# Altium schematic sheet Battery_Prtection.SchDoc: Battery Protection
size A4; CompanyName: TechLabs Global Pvt Ltd; Organization: TechLabs Global Pvt Ltd; DocumentNumber: 1; Revision: 1.0; SheetNumber: 1; SheetTotal: 3
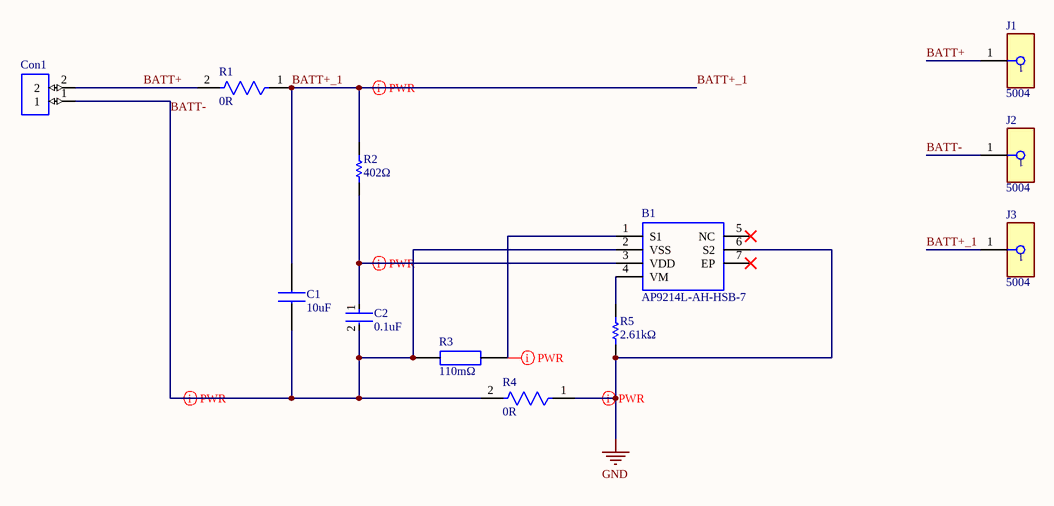
[diagram p0: Battery_Prtection.SchDoc]

## Parts
B1  AP9214L-AH-HSB-7  [AP9214LAHHSB7]
C1  10uF  [CAPC1005X70N]
C2  0.1uF  [FP-CC0402-MFG]
Con1  SM02B-SRSS-TB(LF)(SN)  [SM02B-SRSS-TB(LF)(SN)]  (value not drawn)
J1  5004  [FP-5004-MFG]
J2  5004  [FP-5004-MFG]
J3  5004  [FP-5004-MFG]
R1  0R  [FP-RC0402-0_4-IPC_A]
R2  402Ω  [RESC1005X40X25LL05T10]
R3  110mΩ  [RESC6432X65N]
R4  0R  [FP-RC0402-0_4-IPC_A]
R5  2.61kΩ  [RESC1005X40X25NL05T10]

## Nets
GND: B1.6(S2) R4.1 R5.1
BATT+: Con1.2 J1.1 R1.2
BATT+_1: C1.2 J3.1 R1.1 R2.2
BATT-: B1.2(VSS) C1.1 C2.2 Con1.1 J2.1 R3.1 R4.2
NetB1_1: B1.1(S1) R3.2
NetB1_3: B1.3(VDD) C2.1 R2.1
NetB1_4: B1.4(VM) R5.2

Not connected (* = marked no-connect by the designer): B1 5(NC)* 7(EP)*

## Layout directives
rule Width Constraint [Pref Width = 20mil    Min Width = 12mil    Max Width = 36mil]: BATT+_1, BATT-, GND, NetB1_1, NetB1_3

## Notes on the sheet
- Title
- Size:
- Date:
- A4
- Number:
- Time:
- Revision:
- Sheet
- of
- File:

## Library data of the parts
B1 = AP9214L-AH-HSB-7: Battery Management Sgl Chip Sol 1-Cell 30V Li Battery Mgt; Manufacturer: Diodes Inc.; Geometry.Height: 0.6mm; Mfr. Part #: AP9214L-AH-HSB-7; Mouser Part Number: 621-AP9214L-AH-HSB-7; Mouser Price/Stock: https://www.mouser.co.uk/ProductDetail/Diodes-Incorporated/AP9214L-AH-HSB-7?qs=QGmEbV89MVMVPmL%2Fj7c%2FKQ%3D%3D; Arrow Part Number: AP9214L-AH-HSB-7; Arrow Price/Stock: https://www.arrow.com/en/products/ap9214l-ah-hsb-7/diodes-incorporated; Mouser Testing Part Number: *; Mouser Testing Price/Stock: *; Datasheet Link: https://www.diodes.com/assets/Datasheets/AP9214L.pdf; Digi-Key Part #: AP9214L-AH-HSB-7DITR-ND,AP9214L-AH-HSB-7DICT-ND,AP9214L-AH-HSB-7DIDKR-ND; Package: U-DFN2535-6
C1 = CL05A106MQ5NUNC: CAP CER 10UF 6.3V X5R 0402; Manufacturer: Samsung Electro-Mechanics; Geometry.Height: 0.7mm; Mfr. Part #: CL05A106MQ5NUNC; Mouser Part Number: 187-CL05A106MQ5NUNC; Mouser Price/Stock: https://www.mouser.co.uk/ProductDetail/Samsung-Electro-Mechanics/CL05A106MQ5NUNC?qs=X6jEic%2FHinDK8vVLi1zwpw%3D%3D; Arrow Part Number: CL05A106MQ5NUNC; Arrow Price/Stock: https://www.arrow.com/en/products/cl05a106mq5nunc/samsung-electro-mechanics?region=nac; Datasheet Link: https://datasheet.datasheetarchive.com/originals/distributors/Datasheets-DGA10/2406160.pdf; LCSC Part #: C15525; Package: 0402; Value: 10uF; Digi-Key Part #: 1276-1451-2-ND
C2 = CMP-03422-000773-1: CAP CER 0.1UF 16V X5R 0402; Mfr. Part #: CC0402KRX5R7BB104; Manufacturer: YAGEO; Capacitance: 100 nF; Automotive Grade: NA; Temperature Coefficient: 30ppm/°C; Tolerance: 0.1; Material: Ceramic; Footprint Url: http://www.yageo.com/exep/pages/download/literatures/UPY-C_GEN_24.pdf; ComponentLink2Description: Datasheet; Digikey Description: CAP CER 0.1UF 16V X5R 0402; ComponentLink2URL: http://www.yageo.com/documents/recent/UPY-GP_NP0_16V-to-50V_16.pdf; Device Class L1: Passive Components; Temperature Range High: +125°C; Temperature Range Low: -55°C; Temperature: -55°C to +125°C; Temperature Characteristic: X5R; Octopart: https://octopart.com/cc0402krx5r7bb104-yageo-8376508; Device Class L2: Capacitors; Value: 0.1uF; Voltage Rating: 16 V; Automotive: No; Lead Free: Yes; Height: 0.55mm; Device Class L3: Ceramic Capacitors; Package: CC0402; Mouser Description: Multilayer Ceramic Capacitors MLCC - SMD/SMT 100nF 16V X5R 10%; Ipc Land Pattern Name: CAPC10050X50; RoHS: TRUE; Category: Cap; LCSC Part #: C106204; Digi-Key Part #: 311-1347-2-ND
Con1 = SM02B-SRSS-TB(LF)(SN): Connector Header Surface Mount, Right Angle 2 position 0.039 _1.00mm_; Manufacturer: JST Sales America; MP: SM02B-SRSS-TB_LF__SN_; MF: JST Sales; SnapEDA_Link: https://www.snapeda.com/parts/SM02B-SRSS-TB%28LF%29%28SN%29/JST%20Sales%20America%20Inc./view-part/447499/?ref=snap; Price: None; Value: *; Availability: Unavailable; Package: None; Digi-Key Part #: 455-1802-1-ND; LCSC Part #: C160402; Mfr. Part #: SM02B-SRSS-TB(LF)(SN); Parameter 2: *
J1-J3 = CMP-2000-05575-2: PC TEST POINT MINIATURE YELLOW; Manufacturer: Keystone; Number Of Contacts: 1; Is Female: yes; Device Class L1: Connectors; Mfr. Part #: 5004; Digikey Description: PC TEST POINT MINIATURE YELLOW; ComponentLink2URL: https://www.keyelco.com/product-pdf.cfm?p=1313; Lead Free: Yes; ComponentLink2Description: Datasheet; Category: Conn; Height: 4.72mm; Octopart: https://octopart.com/5004-keystone-28591; Mouser Description: TEST POINT PC MINI .040"D YELLOW; Device Class L3: unset; Contact Material: Silver; Package: 5004; Automotive: No; Device Class L2: unset; RoHS: TRUE; LCSC Part #: C2906762; Digi-Key Part #: 36-5004-ND
R1 R4 = CMP-2002-07342-2: RES SMD 0 OHM JUMPER 1/16W 0402; Manufacturer: YAGEO; Mfr. Part #: RC0402FR-070RL; Temperature Coefficient: 200ppm/°C; Tolerance: 1%; Power Rating: 62.5mW; Voltage Rating: 50V; Max Power Dissipation: 63mW; Resistance: 0R; Features: Moisture Resistant; Length: 1mm; Case Code (Metric): 1005; Series: RC; RoHS Compliant: Yes; Resistor Type: Thick Film; Height: 0.35mm; Min Operating Temperature: -55°C; Case Code (Imperial): 0402; Number of Terminations: 2; Contact Plating: Tin; Package: 0402; Size Code: 0402; Termination: SMD/SMT; Max Operating Temperature: 155°C; Width: 0.5mm; Mount: Surface Mount; Lead Free: Lead Free; Packaging: Tape and Reel; Radiation Hardening: No; LCSC Part #: C106231; Value: 0R; Digi-Key Part #: 311-0.0LRTR-ND
R2 = CMP-2002-07675-1: 50V -55℃~+155℃ ±1% 402Ω Thick Film Resistors 62.5mW ±100ppm/℃ 0402 Chip Resistor - Surface Mount ROHS; Mfr. Part #: RC0402FR-07402RL; Manufacturer: Yageo; Package: 0402; LCSC Part #: C137984; Value: 402Ω; Digi-Key Part #: YAG3152TR-ND
R3 = RL2512FK-070R11L: 1W ±1% ±600ppm/℃ -55℃~+155℃ 110mΩ 2512 Chip Resistor - Surface Mount ROHS; Manufacturer: YAGEO; Geometry.Height: 0.65mm; Mfr. Part #: RL2512FK-070R11L; Mouser Part Number: 603-RL2512FK-070R11L; Mouser Price/Stock: https://www.mouser.co.uk/ProductDetail/Yageo/RL2512FK-070R11L/?qs=x8mT8l3Qr1Hhdc7K4N9hZA%3D%3D; Arrow Part Number: RL2512FK-070R11L; Arrow Price/Stock: https://www.arrow.com/en/products/rl2512fk-070r11l/yageo; Mouser Testing Part Number: *; Mouser Testing Price/Stock: *; Datasheet Link: https://www.yageo.com/upload/media/product/productsearch/datasheet/rchip/PYu-RL_Group_521_RoHS_L_2.pdf; Package: 2512; Value: 110mΩ; LCSC Part #: C876467; Digi-Key Part #: 311-0.11TTR-ND
R5 = CMP-2002-07573-1: 62.5mW Thick Film Resistors 50V ±100ppm/℃ ±1% -55℃~+155℃ 2.61kΩ 0402 Chip Resistor - Surface Mount ROHS; Manufacturer: Yageo / Phycomp; Mfr. Part #: RC0402FR-072K61L; LCSC Part #: C163472; Package: 0402; Value: 2.61kΩ; Tolerance: ±1%; Digi-Key Part #: YAG3103TR-ND